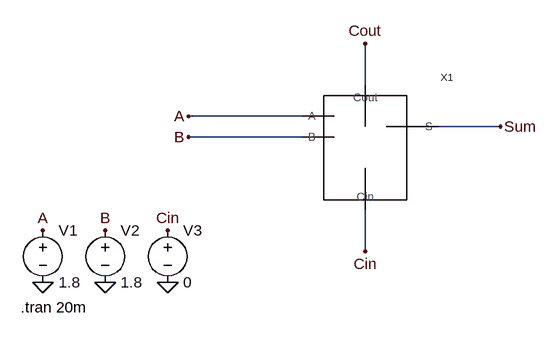
[diagram p0: schematic Draft2.asc]
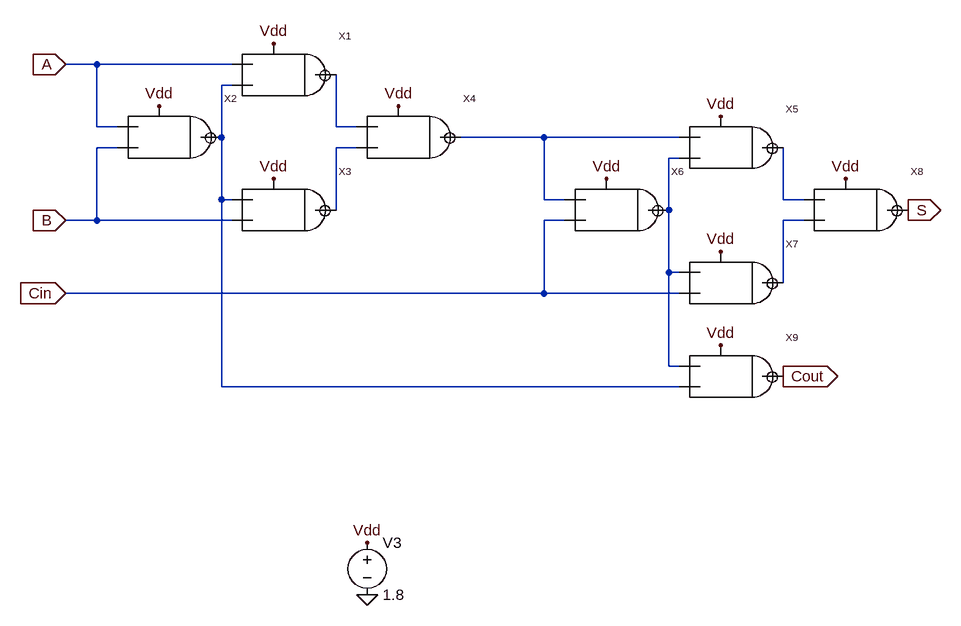
[diagram p1: sub-circuit full_adder.asc]
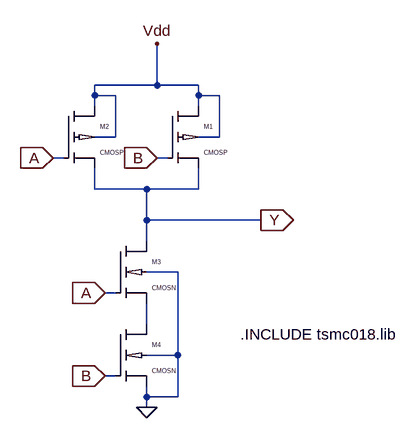
[diagram p2: sub-circuit nand2.asc]
Draft2.asc, the LTspice schematic file:
Version 4
SHEET 1 880 680
WIRE 224 128 224 64
WIRE 128 176 -48 176
WIRE 432 192 336 192
WIRE 128 208 -48 208
WIRE 224 384 224 320
FLAG -48 176 A
FLAG -48 208 B
FLAG 224 384 Cin
FLAG 432 192 Sum
FLAG 224 64 Cout
FLAG -272 352 A
FLAG -176 352 B
FLAG -80 352 Cin
FLAG -80 432 0
FLAG -176 432 0
FLAG -272 432 0
SYMBOL Full_adder 224 224 R0
SYMATTR InstName X1
SYMBOL voltage -272 336 R0
WINDOW 123 0 0 Left 0
WINDOW 39 0 0 Left 0
SYMATTR InstName V1
SYMATTR Value 1.8
SYMBOL voltage -176 336 R0
WINDOW 123 0 0 Left 0
WINDOW 39 0 0 Left 0
SYMATTR InstName V2
SYMATTR Value 1.8
SYMBOL voltage -80 336 R0
WINDOW 123 0 0 Left 0
WINDOW 39 0 0 Left 0
SYMATTR InstName V3
SYMATTR Value 0
TEXT -306 470 Left 2 !.tran 20m

full_adder.asc, the sub-circuit schematic file:
Version 4
SHEET 1 1420 916
WIRE 96 80 48 80
WIRE 304 80 96 80
WIRE 304 112 288 112
WIRE 96 176 96 80
WIRE 128 176 96 176
WIRE 464 176 464 96
WIRE 496 176 464 176
WIRE 288 192 288 112
WIRE 784 192 656 192
WIRE 992 192 784 192
WIRE 128 208 96 208
WIRE 496 208 464 208
WIRE 992 224 976 224
WIRE 288 288 288 192
WIRE 304 288 288 288
WIRE 784 288 784 192
WIRE 816 288 784 288
WIRE 1152 288 1152 208
WIRE 1184 288 1152 288
WIRE 464 304 464 208
WIRE 976 304 976 224
WIRE 96 320 96 208
WIRE 96 320 48 320
WIRE 304 320 96 320
WIRE 816 320 784 320
WIRE 1184 320 1152 320
WIRE 976 400 976 304
WIRE 992 400 976 400
WIRE 1152 416 1152 320
WIRE 784 432 784 320
WIRE 784 432 48 432
WIRE 992 432 784 432
WIRE 976 544 976 400
WIRE 992 544 976 544
WIRE 288 576 288 288
WIRE 992 576 288 576
FLAG 48 80 A
IOPIN 48 80 In
FLAG 48 320 B
IOPIN 48 320 In
FLAG 48 432 Cin
IOPIN 48 432 In
FLAG 1152 560 Cout
IOPIN 1152 560 Out
FLAG 1344 304 S
IOPIN 1344 304 Out
FLAG 1248 256 Vdd
FLAG 1056 160 Vdd
FLAG 1056 368 Vdd
FLAG 1056 512 Vdd
FLAG 880 256 Vdd
FLAG 560 144 Vdd
FLAG 368 48 Vdd
FLAG 368 256 Vdd
FLAG 192 144 Vdd
FLAG 512 816 Vdd
FLAG 512 896 0
SYMBOL NAND2 368 96 R0
SYMATTR InstName X1
SYMBOL NAND2 192 192 R0
SYMATTR InstName X2
SYMBOL NAND2 368 304 R0
SYMATTR InstName X3
SYMBOL NAND2 560 192 R0
SYMATTR InstName X4
SYMBOL NAND2 1056 208 R0
SYMATTR InstName X5
SYMBOL NAND2 880 304 R0
SYMATTR InstName X6
SYMBOL NAND2 1056 416 R0
SYMATTR InstName X7
SYMBOL NAND2 1248 304 R0
SYMATTR InstName X8
SYMBOL NAND2 1056 560 R0
SYMATTR InstName X9
SYMBOL voltage 512 800 R0
WINDOW 123 0 0 Left 0
WINDOW 39 0 0 Left 0
SYMATTR InstName V3
SYMATTR Value 1.8

nand2.asc, the sub-circuit schematic file:
Version 4
SHEET 1 880 680
WIRE 320 16 320 -48
WIRE 320 16 224 16
WIRE 384 16 320 16
WIRE 224 32 224 16
WIRE 256 32 224 32
WIRE 384 32 384 16
WIRE 416 32 384 32
WIRE 224 48 224 32
WIRE 384 48 384 32
WIRE 256 96 256 32
WIRE 256 96 224 96
WIRE 416 96 416 32
WIRE 416 96 384 96
WIRE 176 128 160 128
WIRE 336 128 320 128
WIRE 224 176 224 144
WIRE 304 176 224 176
WIRE 384 176 384 144
WIRE 384 176 304 176
WIRE 304 224 304 176
WIRE 480 224 304 224
WIRE 304 256 304 224
WIRE 352 304 304 304
WIRE 256 336 240 336
WIRE 304 384 304 352
WIRE 352 432 352 304
WIRE 352 432 304 432
WIRE 256 464 240 464
WIRE 304 496 304 480
WIRE 352 496 352 432
WIRE 352 496 304 496
WIRE 304 512 304 496
FLAG 304 512 0
FLAG 160 128 A
IOPIN 160 128 In
FLAG 240 336 A
IOPIN 240 336 In
FLAG 320 128 B
IOPIN 320 128 In
FLAG 240 464 B
IOPIN 240 464 In
FLAG 480 224 Y
IOPIN 480 224 Out
FLAG 320 -48 Vdd
SYMBOL Pcmos 336 48 R0
SYMATTR InstName M1
SYMBOL Pcmos 176 48 R0
SYMATTR InstName M2
SYMBOL Ncmos 256 256 R0
SYMATTR InstName M3
SYMBOL Ncmos 256 384 R0
SYMATTR InstName M4
TEXT 448 400 Left 2 !.INCLUDE tsmc018.lib

The netlist it stands for:
* Draft2.asc
XX1 A B Sum Cin Cout full_adder
V1 A 0 1.8
V2 B 0 1.8
V3 Cin 0 0

* block symbol definitions
.subckt full_adder A B S Cin Cout
XX1 N002 A N001 Vdd nand2
XX2 N001 A B Vdd nand2
XX3 N004 N001 B Vdd nand2
XX4 N003 N002 N004 Vdd nand2
XX5 N006 N003 N005 Vdd nand2
XX6 N005 N003 Cin Vdd nand2
XX7 N007 N005 Cin Vdd nand2
XX8 S N006 N007 Vdd nand2
XX9 Cout N005 N001 Vdd nand2
V3 Vdd 0 1.8
.ends full_adder

.subckt nand2 Y A B Vdd
M1 Vdd B Y Vdd CMOSP
M2 Vdd A Y Vdd CMOSP
M3 Y A N001 0 CMOSN
M4 N001 B 0 0 CMOSN
.INCLUDE tsmc018.lib
.ends nand2

.model NMOS NMOS
.model PMOS PMOS
.lib standard.mos
.tran 20m
.lib tsmc018.lib
.backanno
.end